# Altium schematic sheet 00_McuComBrd.SchDoc
size A4; SheetNumber: 1; SheetTotal: 5
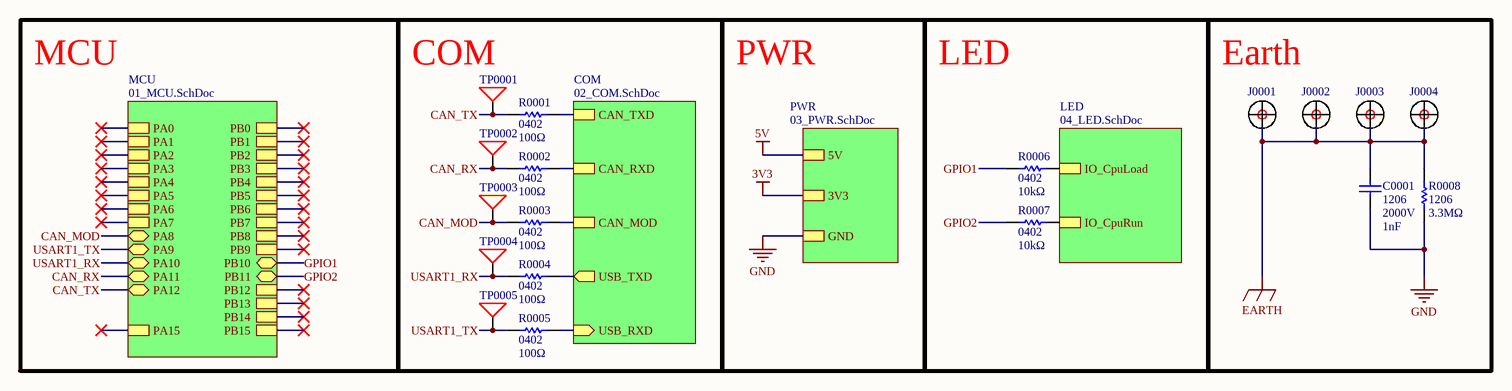
[diagram p0: 00_McuComBrd.SchDoc]

## Parts
C0001  Size: 1206  Volt: 2000V  Cap: 1nF  [C1206]  (hidden comment: Cap)
J0001  HOLE  [定位孔 Φ3 1]  (value not drawn)
J0002  HOLE  [定位孔 Φ3 1]  (value not drawn)
J0003  HOLE  [定位孔 Φ3 1]  (value not drawn)
J0004  HOLE  [定位孔 Φ3 1]  (value not drawn)
R0001  Size: 0402  Res: 100Ω  [R0402]  (hidden comment: RES)
R0002  Size: 0402  Res: 100Ω  [R0402]  (hidden comment: RES)
R0003  Size: 0402  Res: 100Ω  [R0402]  (hidden comment: RES)
R0004  Size: 0402  Res: 100Ω  [R0402]  (hidden comment: RES)
R0005  Size: 0402  Res: 100Ω  [R0402]  (hidden comment: RES)
R0006  Size: 0402  Res: 10kΩ  [R0402]  (hidden comment: RES)
R0007  Size: 0402  Res: 10kΩ  [R0402]  (hidden comment: RES)
R0008  Size: 1206  Res: 3.3MΩ  [R1206]  (hidden comment: RES)
TP0001  Test Point  [Test Point]  (value not drawn)
TP0002  Test Point  [Test Point]  (value not drawn)
TP0003  Test Point  [Test Point]  (value not drawn)
TP0004  Test Point  [Test Point]  (value not drawn)
TP0005  Test Point  [Test Point]  (value not drawn)

## Blocks framed on the sheet
COM: R0001 R0002 R0003 R0004 R0005 TP0001 TP0002 TP0003 TP0004 TP0005
LED: R0006 R0007
Earth: C0001 J0001 J0002 J0003 J0004 R0008

## Sub-sheets
COM = 02_COM.SchDoc: USB_RXD (in), USB_TXD (out), CAN_TXD, CAN_MOD, CAN_RXD
LED = 04_LED.SchDoc: IO_CpuLoad, IO_CpuRun
MCU = 01_MCU.SchDoc: PA1, PA2, PA3, PA4, PA5, PA6, PA7, PA8 (bidir), PA10 (bidir), PA9 (bidir), PA11 (bidir), PA12 (bidir), PA15, PA0, PB0, PB1, PB2, PB3, PB4, PB5, PB7, PB6, PB8, PB9, PB10 (bidir), PB11 (bidir), PB12, PB13, PB15, PB14
PWR = 03_PWR.SchDoc: 5V, 3V3, GND

## Nets
3V3: sheet PWR/3V3
5V: sheet PWR/5V
EARTH: C0001.2 J0001.1 J0002.1 J0003.1 J0004.1 R0008.2
GND: C0001.1 R0008.1 ; sheet PWR/GND
CAN_MOD: R0003.1 TP0003.1 ; sheet MCU/PA8
CAN_RX: R0002.1 TP0002.1 ; sheet MCU/PA11
CAN_TX: R0001.1 TP0001.1 ; sheet MCU/PA12
GPIO1: R0006.1 ; sheet MCU/PB10
GPIO2: R0007.1 ; sheet MCU/PB11
USART1_RX: R0004.1 TP0004.1 ; sheet MCU/PA10
USART1_TX: R0005.1 TP0005.1 ; sheet MCU/PA9
NetR0001_2: R0001.2 ; sheet COM/CAN_TXD
NetR0002_2: R0002.2 ; sheet COM/CAN_RXD
NetR0003_2: R0003.2 ; sheet COM/CAN_MOD
NetR0004_2: R0004.2 ; sheet COM/USB_TXD
NetR0005_2: R0005.2 ; sheet COM/USB_RXD
NetR0006_2: R0006.2 ; sheet LED/IO_CpuLoad
NetR0007_2: R0007.2 ; sheet LED/IO_CpuRun

## Notes on the sheet
- MCU
- PWR

## Library data of the parts
C0001 = Cap: 电容
R0001 R0002 R0003 R0004 R0005 R0006 R0007 R0008 = RES: 电阻; Current: 1A